# EAGLE design tvout_terminal_v1.0 (EAGLE 6.5.0)
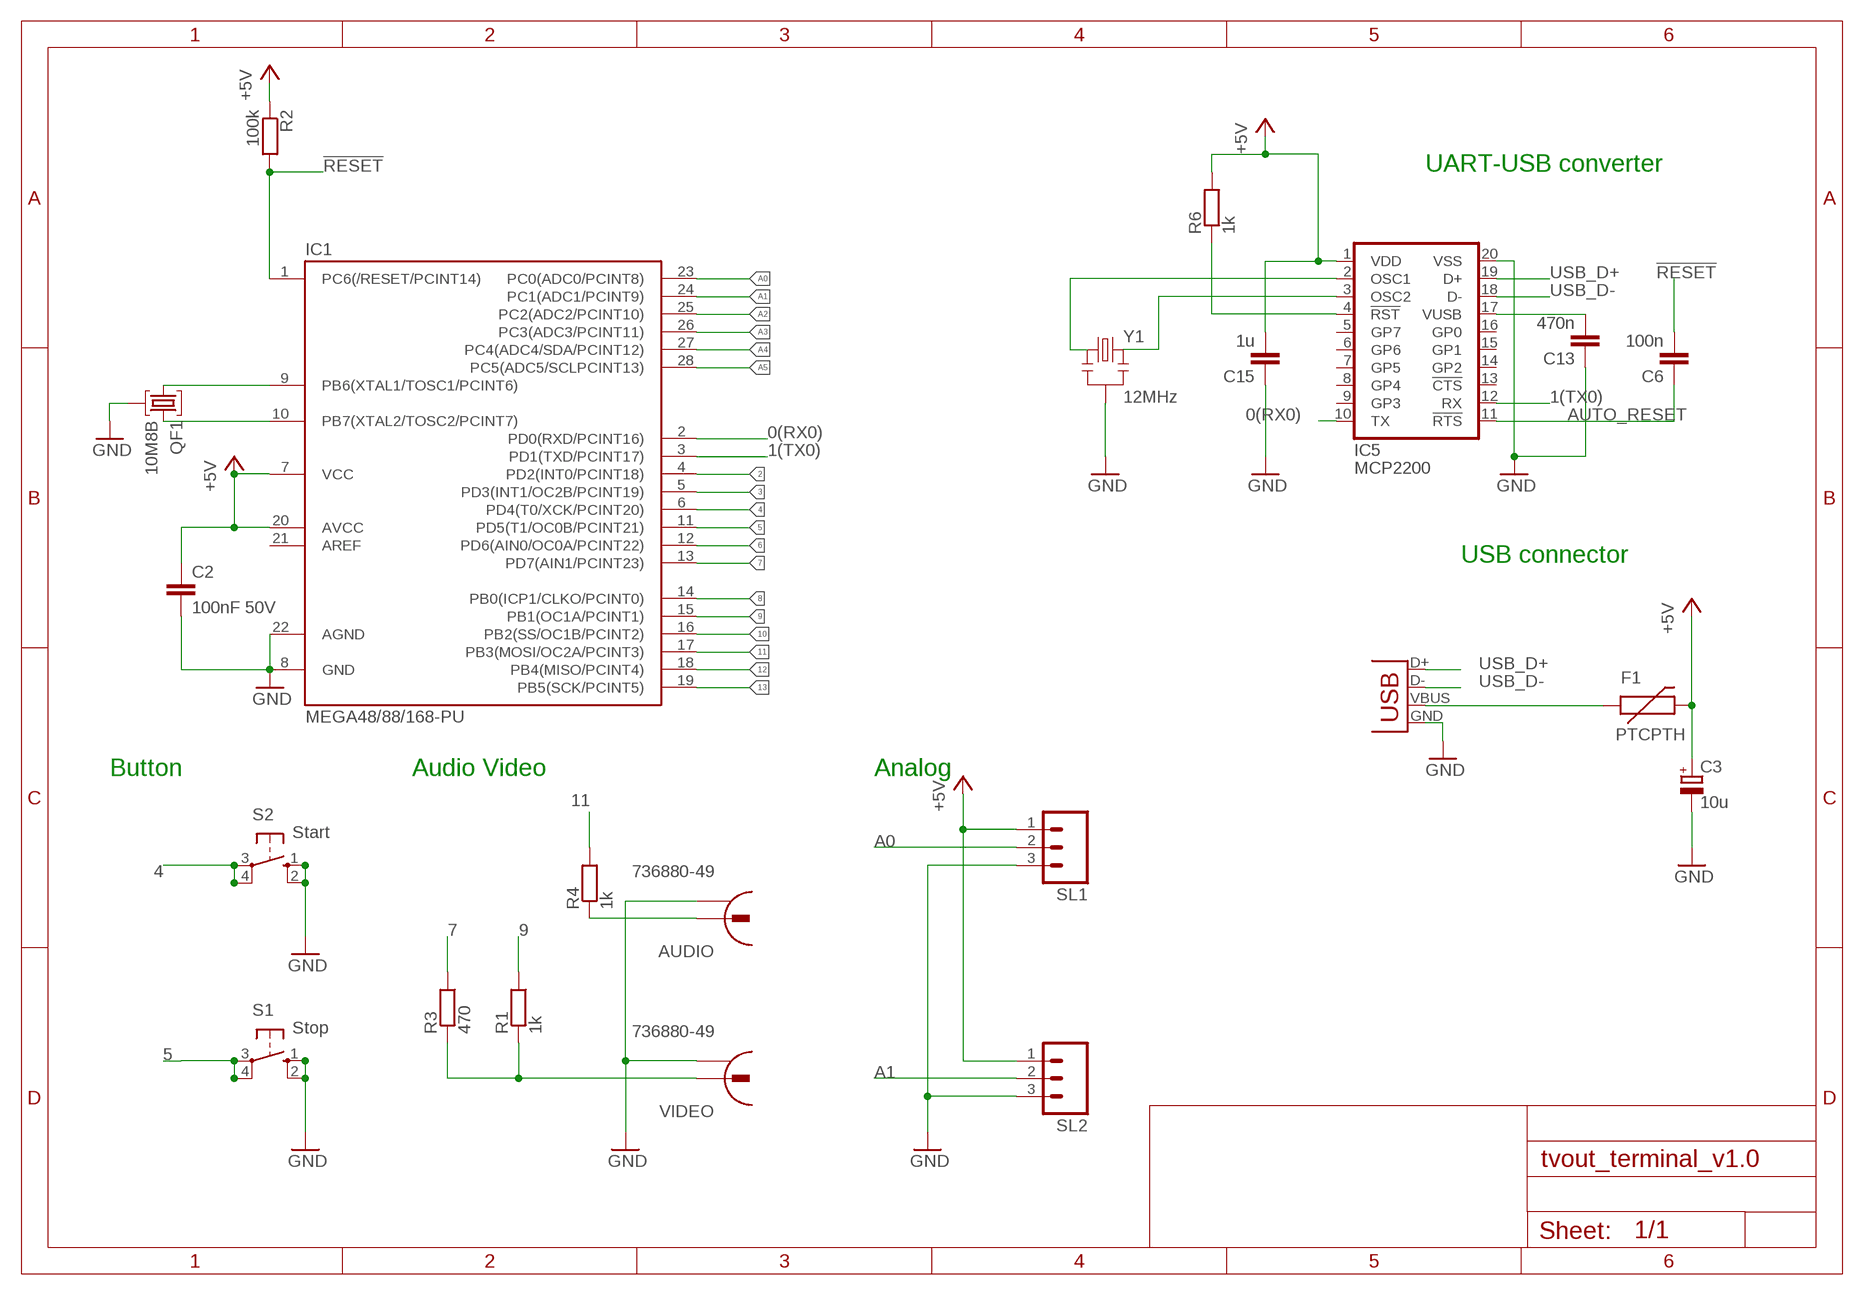
[diagram p0: schematic, sheet 1]

## Parts
AUDIO  736880-49  [736880-49]
C2  100nF 50V  C-EU025-025X050  [C025-025X050]
C3  10u  CPOL-EUE2.5-7  [E2,5-7]
C6  100n  CAPPTH  [CAP-PTH-SMALL]
C13  470n  CAPPTH  [CAP-PTH-SMALL]
C15  1u  CAPPTH  [CAP-PTH-SMALL]
F1  PTCPTH  [PTC]
IC1  MEGA48/88/168-PU  [DIL28-3]
IC5  MCP2200  [SO20]
QF1  10M8B  [HC49U]
R1  1k  RESISTOR  [RES-AXIAL-0.4]
R2  100k  RESISTOR  [RES-AXIAL-0.4]
R3  470  RESISTOR  [RES-AXIAL-0.4]
R4  1k  RESISTOR  [RES-AXIAL-0.4]
R6  1k  RESISTOR  [RES-AXIAL-0.4]
S1  Stop  10-XX  [B3F-10XX]
S2  Start  10-XX  [B3F-10XX]
SL1  M03  [03P]
SL2  M03  [03P]
VIDEO  736880-49  [736880-49]
X3  USB  USBPTH  [USB-B-PTH]
Y1  12MHz  CRYSTAL-RESONATOR  [HC49U-V-RESONATOR]

## Nets
0(RX0): IC1.2(PD0(RXD/PCINT16)) IC5.10(TX)
1(TX0): IC1.3(PD1(TXD/PCINT17)) IC5.12(RX)
2: IC1.4(PD2(INT0/PCINT18))
3: IC1.5(PD3(INT1/OC2B/PCINT19))
4: IC1.6(PD4(T0/XCK/PCINT20)) S2.3(P) S2.4(P1)
5: IC1.11(PD5(T1/OC0B/PCINT21)) S1.3(P) S1.4(P1)
6: IC1.12(PD6(AIN0/OC0A/PCINT22))
7: IC1.13(PD7(AIN1/PCINT23)) R3.P$2
8: IC1.14(PB0(ICP1/CLKO/PCINT0))
9: IC1.15(PB1(OC1A/PCINT1)) R1.P$2
10: IC1.16(PB2(SS/OC1B/PCINT2))
11: IC1.17(PB3(MOSI/OC2A/PCINT3)) R4.P$2
12: IC1.18(PB4(MISO/PCINT4))
13: IC1.19(PB5(SCK/PCINT5))
!RESET: C6.2 IC1.1(PC6(/RESET/PCINT14)) R2.P$2
+5V [power]: C2.1 C3.+ C15.2 F1.P$2 IC1.7(VCC) IC1.20(AVCC) IC5.1(VDD) R2.P$1 R6.P$2 SL1.1 SL2.1
A0: IC1.23(PC0(ADC0/PCINT8)) SL1.2
A1: IC1.24(PC1(ADC1/PCINT9)) SL2.2
A2: IC1.25(PC2(ADC2/PCINT10))
A3: IC1.26(PC3(ADC3/PCINT11))
A4: IC1.27(PC4(ADC4/SDA/PCINT12))
A5: IC1.28(PC5(ADC5/SCLPCINT13))
AUTO_RESET: C6.1 IC5.11(!RTS)
GND [power]: AUDIO.2 C2.2 C3.- C13.1 C15.1 IC1.8(GND) IC1.22(AGND) IC5.20(VSS) QF1.2 S1.1(S) S1.2(S1) S2.1(S) S2.2(S1) SL1.3 SL2.3 VIDEO.2 X3.GND Y1.GND
N$1 [power]: F1.P$1 X3.VBUS
N$2: R1.P$1 R3.P$1 VIDEO.1
N$3: IC1.9(PB6(XTAL1/TOSC1/PCINT6)) QF1.1
N$5: AUDIO.1 R4.P$1
N$7: IC5.3(OSC2) Y1.2
N$12: IC1.10(PB7(XTAL2/TOSC2/PCINT7)) QF1.3
N$14: C13.2 IC5.17(VUSB)
N$18: IC5.2(OSC1) Y1.1
N$21: IC5.4(!RST) R6.P$1
USB_D+: IC5.19(D+) X3.D+
USB_D-: IC5.18(D-) X3.D-
Unconnected: AUDIO.2@2 IC1.21(AREF) IC5.5(GP7) IC5.6(GP6) IC5.7(GP5) IC5.8(GP4) IC5.9(GP3) IC5.13(!CTS) IC5.14(GP2) IC5.15(GP1) IC5.16(GP0) VIDEO.2@2

## Notes on the sheet
- UART-USB converter
- USB connector
- Button | Audio Video | Analog

## Library data of the parts
AUDIO VIDEO = con-conrad:736880-49: Cinch Connector ( RCA Jack ); OC_FARNELL: 592791
C2 = rcl:C-EU: CAPACITOR, European symbol; OC_FARNELL: 1216438
C3 = rcl:CPOL-EU: POLARIZED CAPACITOR, European symbol; OC_FARNELL: 1236657
C6 = SparkFun:CAP: Capacitor Standard 0603 ceramic capacitor, and 0.1" leaded capacitor.; OC_FARNELL: 1216438
C13 = SparkFun:CAP: Capacitor Standard 0603 ceramic capacitor, and 0.1" leaded capacitor.; OC_FARNELL: 1457660
C15 = SparkFun:CAP: Capacitor Standard 0603 ceramic capacitor, and 0.1" leaded capacitor.; OC_FARNELL: 2112910
F1 = SparkFun:PTC: Resettable Fuse PTC Resettable Fuse. Spark Fun Electronics SKU : COM-08357; OC_FARNELL: 1175860
IC1 = avr-7:MEGA48/88/168-PU; OC_FARNELL: 1715487
IC5 = SteveMarple:MCP2200: MCP2200 Microchip USB-UART interface.; OC_FARNELL: 1781148
QF1 = crystal:10M*B: Monolithic Crystal Filters Source: www.vanlong.com; OC_FARNELL: 1448129; OC_NEWARK: unknown
R1 R4 = SteveMarple:RESISTOR: 1/4W PTH resistor; OC_FARNELL: 9339051
R2 R6 = SteveMarple:RESISTOR: 1/4W PTH resistor
R3 = SteveMarple:RESISTOR: 1/4W PTH resistor; OC_FARNELL: 9339531
S1 S2 = switch-omron:10-XX: OMRON SWITCH; MPN: B3F-1000; OC_FARNELL: 176432; OC_NEWARK: 36M3542
SL1 = con-amp-quick:M03: AMP QUICK CONNECTOR; OC_FARNELL: 1675765; OC_NEWARK: unknown
SL2 = con-amp-quick:M03: AMP QUICK CONNECTOR; OC_FARNELL: unknown; OC_NEWARK: unknown
X3 = SteveMarple:USB: USB Connectors USB-B-PTH is fully proven SKU : PRT-00139 USB-miniB is fully proven SKU : PRT-00587 USB-A-PCB is untested. USB-A-H is throughly reviewed, but untested. Spark Fun Electronics SKU : PRT-00437 USB-B-SMT is throughly reviewed, but untested. Needs silkscreen touching up. USB-A-S has not been used/tested USB-MB-H has not been used/tested; 0C_FARNELL: 1308876
Y1 = SteveMarple:CRYSTAL-RESONATOR: Crystal/resonator; OC_FARNELL: 1448128; OPTION: Crystal or ceramic resonator. Max 12MHz for 3V3 operation.

## Net classes
1 power: width 0.381 mm

## Board
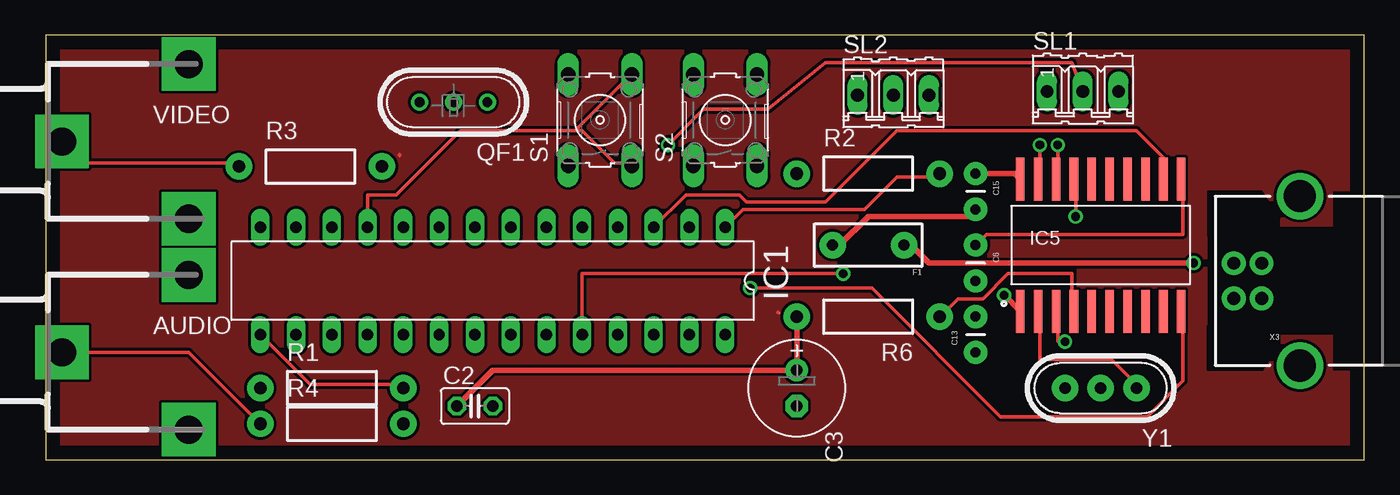
[diagram p1: board, top side]
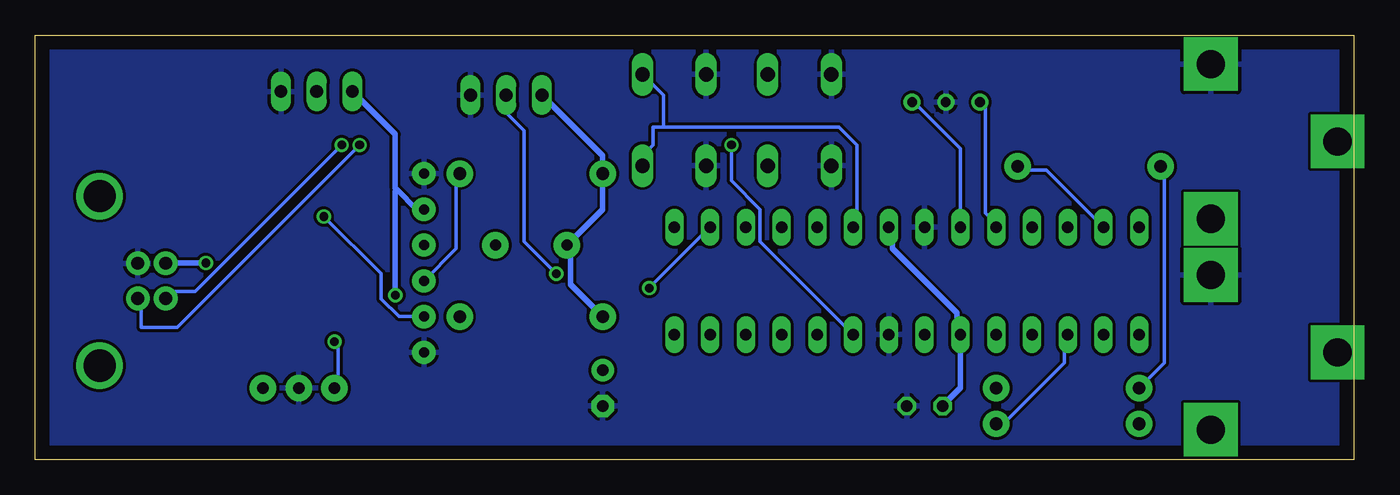
[diagram p2: board, bottom side, seen from below]

Size 93.65 x 30.16 mm. Coordinates in mm from the lower left corner, seen from the top.
Outline: 0,0 93.65,0 93.65,30.16 0,30.16 0,0
Copper layers (1*16): Top 0.035mm / dielectric 1.5mm / Bottom 0.035mm
Design rules "default": minimum track width 10mil, minimum drill 24mil, track to track 8mil, track to pad 8mil, pad to pad 8mil, via to via 8mil, smd to smd 8mil, copper to edge 40mil, drill to drill 8mil, minimum pad ring 10mil, minimum via ring 8mil, stop-mask expansion 4mil, vias tented up to drill 0mil, thermal gap 10mil

### Footprints (pad centres in the part's own frame; a part is rotated, then mirrored left to right if it is on the bottom)
736880-49 = drill 2 pad 3.81 square: 1 -3.92,0; 2 5.08,5.5; 2@2 5.08,-5.5
C025-025X050 = drill 0.813 octagon: 1 -1.27,0; 2 1.27,0
E2,5-7 = drill 0.813 pad 1.6: + -1.27,0 | drill 0.813 pad 1.6 octagon: - 1.27,0
CAP-PTH-SMALL = drill 0.7 pad 1.651: 1 0,0; 2 2.54,0
PTC = drill 0.8 pad 1.88: P$1 -2.54,0; P$2 2.54,0
DIL28-3 = drill 0.813 long: 1 -16.51,-3.81; 2 -13.97,-3.81; 3 -11.43,-3.81; 4 -8.89,-3.81; 5 -6.35,-3.81; 6 -3.81,-3.81; 7 -1.27,-3.81; 8 1.27,-3.81; 9 3.81,-3.81; 10 6.35,-3.81; 11 8.89,-3.81; 12 11.43,-3.81; 13 13.97,-3.81; 14 16.51,-3.81; 15 16.51,3.81; 16 13.97,3.81; 17 11.43,3.81; 18 8.89,3.81; 19 6.35,3.81; 20 3.81,3.81; 21 1.27,3.81; 22 -1.27,3.81; 23 -3.81,3.81; 24 -6.35,3.81; 25 -8.89,3.81; 26 -11.43,3.81; 27 -13.97,3.81; 28 -16.51,3.81
SO20 = smd 0.61 x 3.048: 1 -5.715,-4.699; 2 -4.445,-4.699; 3 -3.175,-4.699; 4 -1.905,-4.699; 5 -0.635,-4.699; 6 0.635,-4.699; 7 1.905,-4.699; 8 3.175,-4.699; 9 4.445,-4.699; 10 5.715,-4.699; 11 5.715,4.699; 12 4.445,4.699; 13 3.175,4.699; 14 1.905,4.699; 15 0.635,4.699; 16 -0.635,4.699; 17 -1.905,4.699; 18 -3.175,4.699; 19 -4.445,4.699; 20 -5.715,4.699
HC49U = drill 0.7 pad 1.2: 1 -2.413,0; 2 -0.027,0; 3 2.413,0
RES-AXIAL-0.4 = drill 0.9 pad 1.88: P$1 -5.08,0; P$2 5.08,0
B3F-10XX = drill 1.016 long: 1 -3.251,2.261; 2 3.251,2.261; 3 -3.251,-2.261; 4 3.251,-2.261
03P = drill 0.914 long: 1 -2.54,0; 2 0,0; 3 2.54,0
USB-B-PTH = drill 0.914 pad 1.676: D+ 0,1.25; D- 1.981,1.25; GND 0,-1.25; VBUS 1.981,-1.25 | drill 2.286: S1 -2.718,-6.02; S2 -2.718,6.02
HC49U-V-RESONATOR = drill 0.813 pad 1.88: 1 -2.54,0; 2 2.54,0; GND 0,0

### Placement (x,y rotation side)
AUDIO  5.08,7.62 0 top
C2  30.48,3.81 0 top
C3  53.34,5.08 270 top
C6  66.04,15.24 270 top
C13  66.04,7.62 90 top
C15  66.04,20.32 270 top
F1  58.42,15.24 180 top
IC1  31.75,12.7 180 top
IC5  74.93,15.24 0 top
QF1  28.96,25.4 180 top
R1  20.32,5.08 0 top
R2  58.42,20.32 0 top
R3  18.8,20.83 0 top
R4  20.32,2.54 0 top
R6  58.42,10.16 180 top
S1  39.37,24.13 90 top
S2  48.26,24.13 90 top
SL1  73.66,26.16 0 top
SL2  60.2,25.91 0 top
VIDEO  5.08,22.61 0 top
X3  86.36,12.7 180 top
Y1  74.93,5.08 180 top

### Tracks (layer width: path | path; a pad name or v marks a point on that pad's centre or on a via)
0(RX0)  (via drill 0.61)
  Top 0.254: v50.04,12.19 58.67,12.19 67.82,3.05 78.23,3.05 80.77,5.59 80.77,10.41 IC5.10
  Bottom 0.254: v50.04,12.19 IC1.2
1(TX0)
  Top 0.254: IC1.3 45.47,18.8 49.28,18.8 49.78,18.29 55.37,18.29 60.45,23.37 77.47,23.37 79.5,21.34 79.5,20.07 IC5.12
4
  Bottom 0.254: IC1.6 35.31,16.76 35.31,22.35 36.58,23.62 49.02,23.62 | 49.02,23.62 49.78,23.62 49.78,22.35 50.29,21.84 50.29,21.08 S2.3 | 49.02,23.62 49.02,25.91 50.29,27.18 S2.4
5
  Top 0.254: IC1.11 22.86,18.8 24.89,18.8 29.46,23.37 37.59,23.37 | 37.59,23.37 38.1,23.37 40.39,21.08 41.4,21.08 S1.3 | 37.59,23.37 41.4,27.18 S1.4
7
  Bottom 0.254: IC1.13 21.84,20.57 23.88,20.57 R3.P$2
9
  Top 0.254: IC1.15 18.8,5.33 25.15,5.33 R1.P$2
11
  Bottom 0.254: IC1.17 20.57,8.64 20.57,6.86 24.89,2.54 R4.P$2
!RESET
  Top 0.254: IC1.1 49.53,17.78 58.17,17.78 60.45,20.07 63.25,20.07 R2.P$2
  Bottom 0.254: C6.2 63.75,14.99 63.75,20.07 R2.P$2
+5V  (via drill 0.61)
  Top 0.381: v68.07,11.68 IC5.1 | R6.P$2 C3.+ 31.75,6.35 C2.1 | C15.2 65.53,17.27 58.42,17.27 56.39,15.24 F1.P$2
  Bottom 0.381: SL1.1 68.07,23.11 68.07,19.3 67.94,19.18 | 67.94,19.18 66.55,17.78 C15.2 | v68.07,11.68 68.07,19.05 67.94,19.18 | C2.1 27.94,5.08 IC1.20 28.19,9.14 28.19,10.41 32.77,14.99 32.77,16.26 IC1.7 | SL2.1 53.34,21.59 R2.P$1 53.34,17.78 F1.P$2 55.63,15.24 55.63,12.45 R6.P$2
A0  (via drill 0.61)
  Top 0.254: v44.2,22.35 46.74,24.89 51.31,24.89 55.37,28.19 72.9,28.19 SL1.2
  Bottom 0.254: IC1.23 42.16,15.49 42.16,17.78 44.2,19.81 v44.2,22.35
A1  (via drill 0.61)
  Top 0.254: IC1.24 38.1,13.21 v56.64,13.21
  Bottom 0.254: v56.64,13.21 58.93,15.49 58.93,23.37 60.2,24.64 SL2.2
AUTO_RESET
  Top 0.254: C6.1 66.8,16 80.77,16 80.77,19.81 IC5.11
GND
  Top 0.381: IC5.20 68.83,20.32 C15.1
  pour Bottom: 0,30.48 0,0 93.98,0 93.98,30.48
N$1  (via drill 0.61)
  Top 0.381: v81.53,13.97 62.74,13.97 61.47,15.24 F1.P$1
  Bottom 0.381: v81.53,13.97 84.33,13.97 X3.VBUS
N$2
  Top 0.254: R3.P$1 13.46,21.08 2.79,21.08 1.27,22.61 VIDEO.1
  Bottom 0.254: R1.P$1 13.46,6.86 13.46,20.57 R3.P$1
N$3
  Bottom 0.254: IC1.9 27.94,22.1 31.24,25.4 QF1.1
N$4
  Top 0.254: 25.15,21.59 25.15,21.67 | 52.07,10.41 52,10.44
  pour Top: 0,30.48 0,0 93.98,0 93.98,30.48
N$5
  Top 0.254: R4.P$1 10.16,7.62 AUDIO.1
N$7  (via drill 0.61)
  Top 0.254: v72.39,8.38 71.88,8.38 71.88,10.41 IC5.3
  Bottom 0.254: v72.39,8.38 72.14,8.13 72.14,5.33 Y1.2
N$12
  Bottom 0.254: IC1.10 25.4,16.76 26.16,17.53 26.16,25.15 26.42,25.4 QF1.3
N$14  (via drill 0.61)
  Top 0.254: v73.15,17.27 73.15,19.81 IC5.17
  Bottom 0.254: v73.15,17.27 69.09,13.21 69.09,11.43 67.82,10.16 C13.2
N$18
  Top 0.254: Y1.1 77.47,5.33 75.69,7.11 70.61,7.11 70.61,10.41 IC5.2
N$21
  Top 0.254: R6.P$1 64.77,11.43 66.55,11.43 68.33,13.21 72.9,13.21 72.9,10.67 IC5.4
USB_D+  (via drill 0.61)
  Top 0.254: v70.61,22.35 70.61,20.07 IC5.19
  Bottom 0.254: v70.61,22.35 83.57,9.4 86.11,9.4 86.11,11.18 86.36,11.43 X3.D+
USB_D-  (via drill 0.61)
  Top 0.254: v71.88,22.35 71.88,20.07 IC5.18
  Bottom 0.254: v71.88,22.35 82.3,11.94 84.33,11.94 84.33,11.68 X3.D-